# EAGLE design Set-Mile-Bottom (EAGLE 9.6.2)
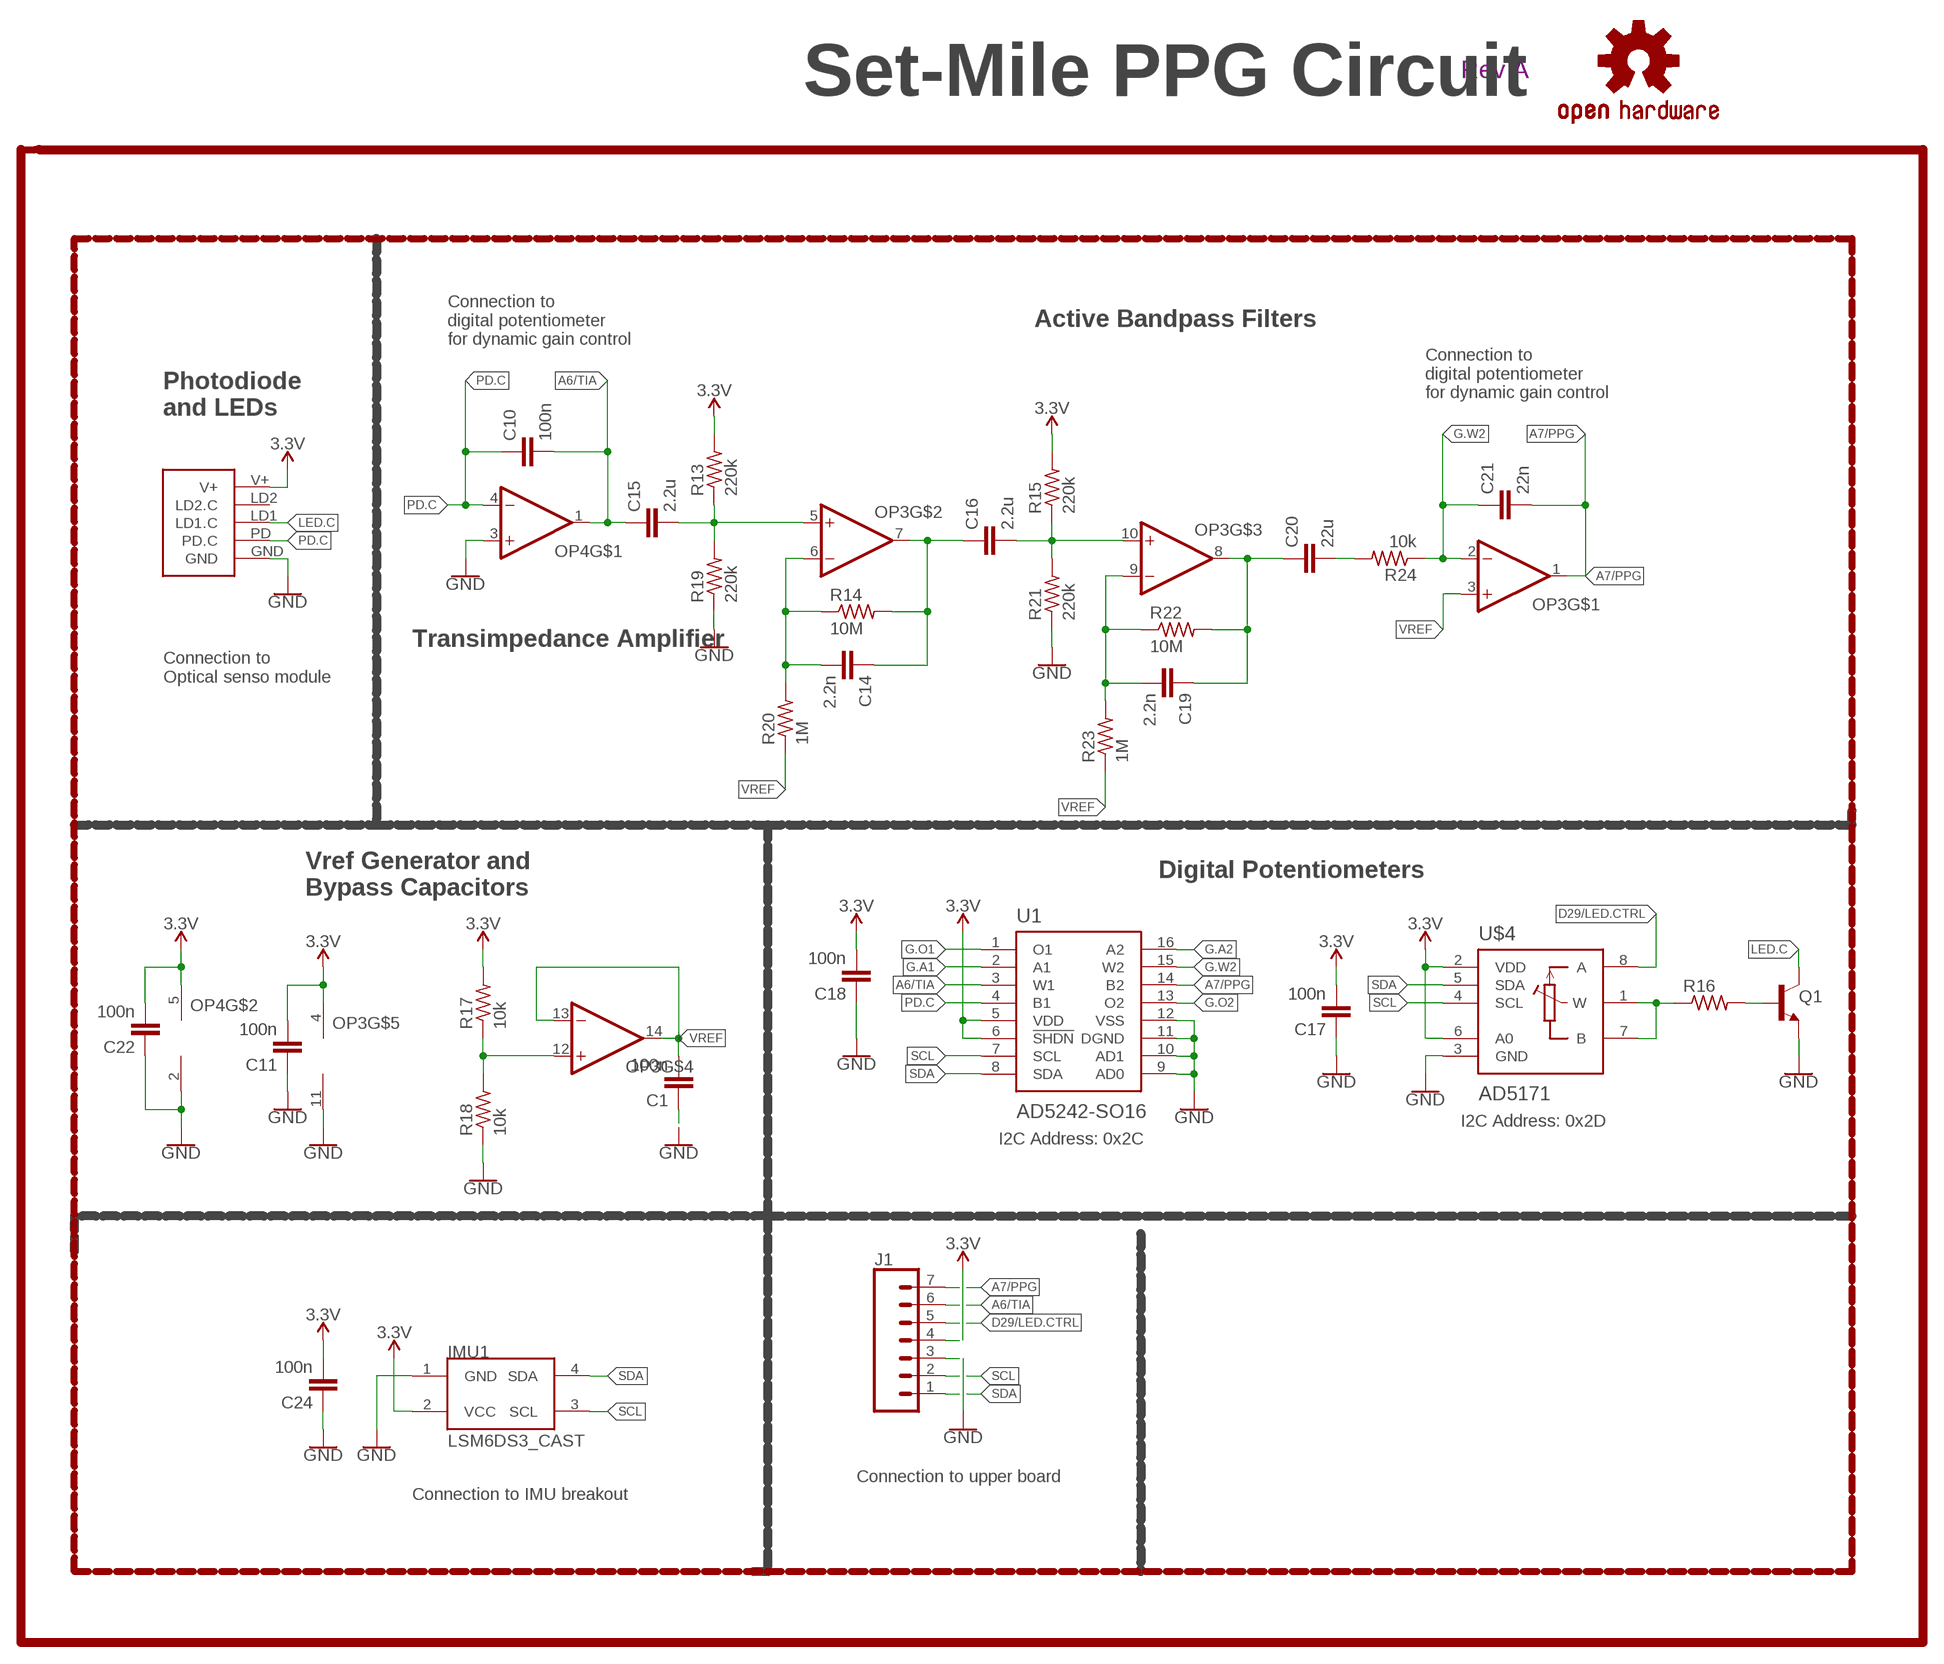
[diagram p0: schematic, sheet 1]

## Parts
C1  100n  CAPACITOR0603  [C0603]
C10  100n  CAPACITOR0603  [C0603]
C11  100n  CAPACITOR0603  [C0603]
C14  2.2n  CAPACITOR0603  [C0603]
C15  2.2u  CAPACITOR0603  [C0603]
C16  2.2u  CAPACITOR0603  [C0603]
C17  100n  CAPACITOR0603  [C0603]
C18  100n  CAPACITOR0603  [C0603]
C19  2.2n  CAPACITOR0603  [C0603]
C20  22u  CAPACITOR0603  [C0603]
C21  22n  CAPACITOR0603  [C0603]
C22  100n  CAPACITOR0603  [C0603]
C24  100n  CAPACITOR0603  [C0603]
IMU1  LSM6DS3_CAST  [LSM6DS3_CAST]
J1  CONN_07-1.27MM  [1X07_1.27MM]
LOGO1  REVISION.A  [REV.A]
LOGO2  OSHW-LOGOL  [OSHW-LOGO-L]
OP3  OP-QUAD-SO14  [SO14]
OP4  OP-SINGLEOT  [SOT23-5]
Q1  NPN-GENERIC  [SOT23-3]
R13  220k  RESISTOR0603  [R0603]
R14  10M  RESISTOR0603  [R0603]
R15  220k  RESISTOR0603  [R0603]
R16  RESISTOR0603  [R0603]
R17  10k  RESISTOR0402  [R0402]
R18  10k  RESISTOR0402  [R0402]
R19  220k  RESISTOR0603  [R0603]
R20  1M  RESISTOR0603  [R0603]
R21  220k  RESISTOR0603  [R0603]
R22  10M  RESISTOR0603  [R0603]
R23  1M  RESISTOR0603  [R0603]
R24  10k  RESISTOR0603  [R0603]
U1  AD5242-SO16  [SO16]
U$3  PPG.MODULE.2  [PPG.MODULE.2]
U$4  AD5171  [SOT-23-8]

## Nets
3.3V: C11.2 C17.2 C18.2 C22.2 C24.2 IMU1.2(VCC) J1.4 OP3.4(V+) OP4.5(V+) R13.2 R15.2 R17.2 U1.5(VDD) U1.6(!SHDN) U$3.V+ U$4.2(VDD) U$4.6(A0)
A6/TIA: C10.2 C15.1 J1.6 OP4.1(OUT) U1.3(W1)
A7/PPG: C21.2 J1.7 OP3.1(OUT) U1.14(B2)
D29/LED.CTRL: J1.5 U$4.8(A)
G.A1: U1.2(A1)
G.A2: U1.16(A2)
G.O1: U1.1(O1)
G.O2: U1.13(O2)
G.W2: C21.1 OP3.2(-IN) R24.1 U1.15(W2)
GND: C1.1 C11.1 C17.1 C18.1 C22.1 C24.1 IMU1.1(GND) J1.3 OP3.11(V-) OP4.2(V-) OP4.3(+IN) Q1.2(E) R18.1 R19.1 R21.1 U1.9(AD0) U1.10(AD1) U1.11(DGND) U1.12(VSS) U$3.GND U$4.3(GND)
LED.C: Q1.3(C) U$3.LD1(LD1.C)
N$8: Q1.1(B) R16.2
N$9: R16.1 U$4.1(W) U$4.7(B)
N$10: OP3.12(+IN) R17.1 R18.2
N$13: C15.2 OP3.5(+IN) R13.1 R19.2
N$15: C14.2 OP3.6(-IN) R14.1 R20.2
N$16: C14.1 C16.1 OP3.7(OUT) R14.2
N$17: C16.2 OP3.10(+IN) R15.1 R21.2
N$18: C19.2 OP3.9(-IN) R22.1 R23.2
N$19: C19.1 C20.1 OP3.8(OUT) R22.2
N$20: C20.2 R24.2
PD.C: C10.1 OP4.4(-IN) U1.4(B1) U$3.PD(PD.C)
SCL: IMU1.3(SCL) J1.2 U1.7(SCL) U$4.4(SCL)
SDA: IMU1.4(SDA) J1.1 U1.8(SDA) U$4.5(SDA)
VREF: C1.2 OP3.3(+IN) OP3.13(-IN) OP3.14(OUT) R20.1 R23.1
Unconnected: U$3.LD2(LD2.C)

## Notes on the sheet
- Set-Mile PPG Circuit
- Active Bandpass Filters
- Connection to
  digital potentiometer
  for dynamic gain control
- Connection to
  digital potentiometer
  for dynamic gain control
- Photodiode
  and LEDs
- Transimpedance Amplifier
- Connection to
  Optical senso module
- Digital Potentiometers
- Vref Generator and 
  Bypass Capacitors
- I2C Address: 0x2D
- I2C Address: 0x2C
- Connection to upper board
- Connection to IMU breakout

## Library data of the parts
C1 C10 C11 C14-C22 C24 = LinnesLab-Passives:CAPACITOR
IMU1 = LinnesLab-Sensors:LSM6DS3_CAST
J1 = LinnesLab-Connectors:CONN_07: Multi connection point. Often used as Generic Header-pin footprint for 0.1 inch spaced/style header connections On any of the 0.1 inch spaced packages, you can populate with these: Break Away Headers - Straight <https://www.sparkfun.com/products/116> (PRT-00116) Break Away Male Headers - Right Angle <https://www.sparkfun.com/products/553> (PRT-00553) Female Headers <https://www.sparkfun.com/products/115> (PRT-00115) Break Away Headers - Machine Pin <https://www.sparkfun.com/products/117> (PRT-00117) Break Away Female Headers - Swiss Machine Pin <https://www.sparkfun.com/products/743> (PRT-00743) For SCREWTERMINALS and SPRING TERMINALS visit here: Screw Terimnals on SparkFun.com <https://www.sparkfun.com/search/results?term=Screw+Terminals> (5mm/3.5mm/2.54mm spacing) This device is also useful as a general connection point to wire up your design to another part of your project. Our various solder wires solder well into these plated through hole pads. Hook-Up Wire - Assortment (Stranded, 22 AWG) <https://www.sparkfun.com/products/11375> (PRT-11375) Hook-Up Wire - Assortment (Solid Core, 22 AWG) <https://www.sparkfun.com/products/11367> (PRT-11367) View the entire wire category on our website here <https://www.sparkfun.com/categories/141> Special notes: Molex polarized connector foot print use with SKU : PRT-08231 with associated crimp pins and housings. 1MM SMD Version SKU: PRT-10208 NOTES ON THE VARIANTS LOCK and LOCK_LONGPADS... This footprint was designed to help hold the alignment of a through-hole component (i.e. 6-pin header) while soldering it into place. You may notice that each hole has been shifted either up or down by 0.005 of an inch from it's more standard position (which is a perfectly straight line). This slight alteration caused the pins (the squares in the middle) to touch the edges of the holes. Because they are alternating, it causes a "brace" to hold the component in place. 0.005 has proven to be the perfect amount of "off-center" position when using our standard breakaway headers. Although looks a little odd when you look at the bare footprint, once you have a header in there, the alteration is very hard to notice. Also,if you push a header all the way into place, it is covered up entirely on the bottom side.
LOGO1 = LinnesLab-Logos:REVISION.A
LOGO2 = LinnesLab-Logos:OSHW-LOGO: Open-Source Hardware (OSHW) Logo This logo indicates the piece of hardware it is found on incorporates a OSHW license and/or adheres to the definition of open source hardware found here: http://freedomdefined.org/OSHW
OP3 = LinnesLab-AnalogIC:OP-QUAD: General symbol and footprints for Quad Op Amps. Use with any standard general purpose op amp.
OP4 = LinnesLab-AnalogIC:OP-SINGLE: Single Op Amp 2.7V to 6.0V Single Supply CMOS Source: http://ww1.microchip.com/downloads/en/DeviceDoc/21314g.pdf
Q1 = LinnesLab-DiscreteSemi:NPN
R13-R24 = LinnesLab-Passives:RESISTOR
U1 = LinnesLab-DigitalIC:AD5242
U$3 = LinnesLab-Connectors:PPG.MODULE.2: Digi-Key Part Number: S9014E-50-ND Manufacturer Part Number: GRPB501VWVN-RC Description: 1mm insulation height 0.05in pitch 50 positions
U$4 = LinnesLab-DigitalIC:AD5171

## Net classes
1 power: width 0.254 mm

## Board
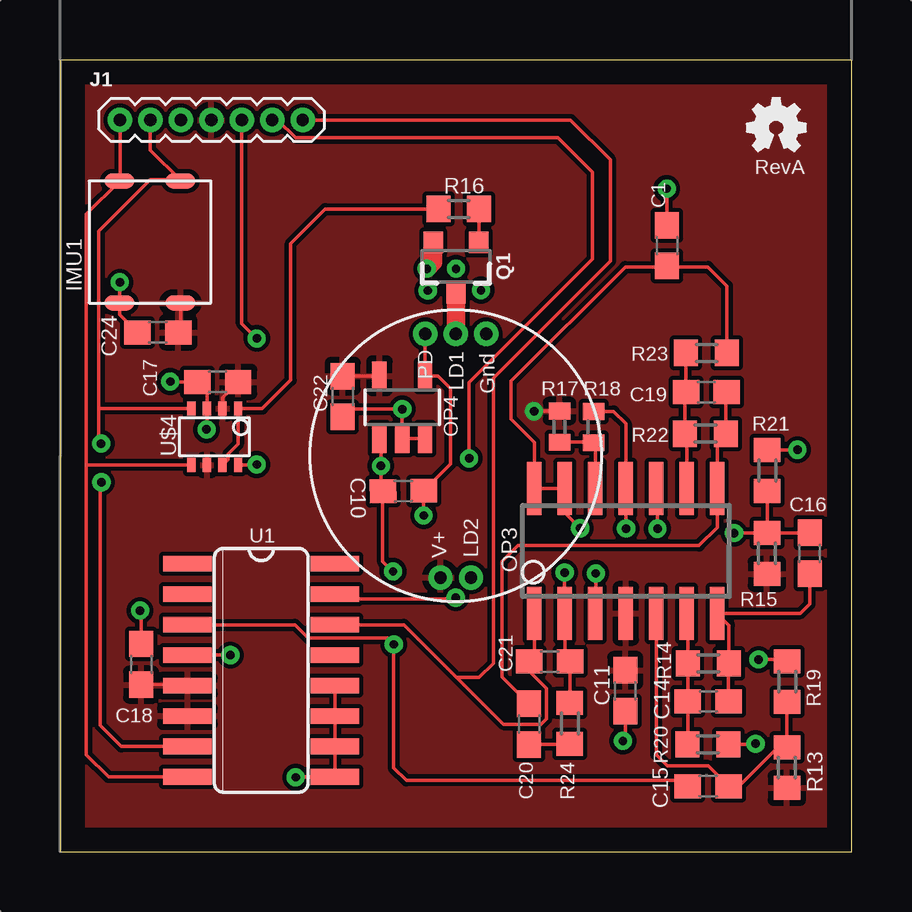
[diagram p1: board, top side]
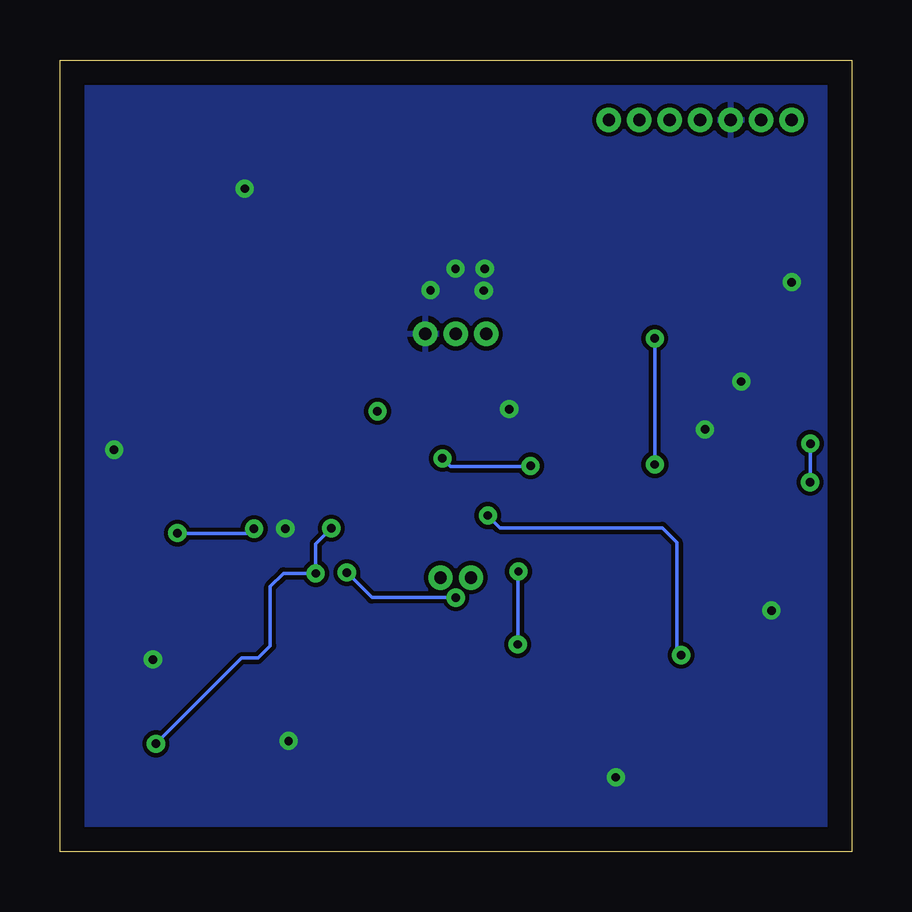
[diagram p2: board, bottom side, seen from below]

Size 33 x 33 mm. Coordinates in mm from the lower left corner, seen from the top.
Outline: 0,0 33,0 33,33 0,33 0,0
Copper layers (1*16): Top 0.035mm / dielectric 1.5mm / Bottom 0.035mm
Design rules "default": minimum track width 6mil, minimum drill 0.35mm, track to track 6mil, track to pad 6mil, pad to pad 6mil, via to via 6mil, smd to smd 6mil, copper to edge 40mil, drill to drill 6mil, minimum pad ring 10mil, minimum via ring 8mil, stop-mask expansion 4mil, vias tented up to drill 0mil, thermal gap 10mil

### Footprints (pad centres in the part's own frame; a part is rotated, then mirrored left to right if it is on the bottom)
C0603 = smd 1.1 x 1: 1 -0.85,0; 2 0.85,0
LSM6DS3_CAST = smd 0.635 x 1.27: 1 -2.54,1.27; 2 -2.54,-1.27; 3 2.54,-1.27; 4 2.54,1.27
1X07_1.27MM = drill 0.508 pad 1: 1 0,0; 2 1.27,0; 3 2.54,0; 4 3.81,0; 5 5.08,0; 6 6.35,0; 7 7.62,0
SO14 = smd 0.6 x 2.2: 1 -3.81,-2.6; 2 -2.54,-2.6; 3 -1.27,-2.6; 4 0,-2.6; 5 1.27,-2.6; 6 2.54,-2.6; 7 3.81,-2.6; 8 3.81,2.6; 9 2.54,2.6; 10 1.27,2.6; 11 0,2.6; 12 -1.27,2.6; 13 -2.54,2.6; 14 -3.81,2.6
SOT23-5 = smd 0.6 x 1.2: 1 -0.95,-1.306; 2 0,-1.306; 3 0.95,-1.306; 4 0.95,1.306; 5 -0.95,1.306
SOT23-3 = smd 0.8 x 0.9: 1 -0.95,-1; 2 0.95,-1; 3 0,1.1
R0603 = smd 1 x 1.1: 1 -0.85,0; 2 0.85,0
R0402 = smd 0.7 x 0.9: 1 -0.65,0; 2 0.65,0
SO16 = smd 0.66 x 2.032: 1 -4.445,-3.073; 2 -3.175,-3.073; 3 -1.905,-3.073; 4 -0.635,-3.073; 5 0.635,-3.073; 6 1.905,-3.073; 7 3.175,-3.073; 8 4.445,-3.073; 9 4.445,3.073; 10 3.175,3.073; 11 1.905,3.073; 12 0.635,3.073; 13 -0.635,3.073; 14 -1.905,3.073; 15 -3.175,3.073; 16 -4.445,3.073
PPG.MODULE.2 = drill 0.508 pad 0.94: GND 1.27,5.08; LD1 0,5.08; LD2 0.635,-5.08; PD -1.27,5.08; V+ -0.635,-5.08
SOT-23-8 = smd 0.35 x 0.6: 1 -0.991,-1.176; 2 -0.341,-1.176; 3 0.309,-1.176; 4 0.959,-1.176; 5 0.959,1.176; 6 0.309,1.176; 7 -0.341,1.176; 8 -0.991,1.176

### Placement (x,y rotation side)
C1  25.3,25.26 270 top
C10  14.32,15.03 180.6 top
C11  23.56,6.7 90 top
C14  27.02,6.27 180 top
C15  27.02,2.72 0 top
C16  31.26,12.44 90 top
C17  6.58,19.58 0 top
C18  3.39,7.81 270 top
C19  26.95,19.15 180 top
C20  19.55,5.32 270 top
C21  20.42,7.93 180 top
C22  11.79,18.97 90 top
C24  4.08,21.65 0 top
IMU1  3.75,25.41 90 top
J1  2.5,30.5 0 top
LOGO1  28.97,28.24 0 top
LOGO2  -4.62,-6.11 0 top  (outside the outline)
OP3  23.59,12.53 0 top
OP4  14.27,18.52 0 top
Q1  16.51,24.39 180 top
R13  30.31,3.5 270 top
R14  27.03,7.84 0 top
R15  29.48,12.43 270 top
R16  16.63,26.78 0 top
R17  20.83,17.71 90 top
R18  22.24,17.7 270 top
R19  30.32,7.08 270 top
R20  27.01,4.47 180 top
R21  29.48,15.89 270 top
R22  26.91,17.42 0 top
R23  26.95,20.79 180 top
R24  21.25,5.34 270 top
U1  8.39,7.55 270 top
U$1  [OSHW-LOGO-MINI]  29.86,30.19 0 top
U$3  16.5,16.5 0 top
U$4  6.44,17.29 180 top

### Tracks (layer width: path | path; a pad name or v marks a point on that pad's centre or on a via)
3.3V  (via drill 0.35)
  Top 0.152: R17.2 v19.77,18.36 v19.76,18.36 | C18.2 5.25,6.98 U1.5 | C22.2 11.8,19.83 OP4.5 | C24.2 5.02,21.73 IMU1.2 | U$4.2 6.78,18.93 C17.2 | 6.13,16.47 U$4.6
  pour Top (isolate 0.178): 0.65,32.5 32.4,32.5 32.4,0.83 0.65,0.83
A6/TIA  (via drill 0.35)
  Top 0.152: OP4.1 13.38,17.16 v13.38,16.08 13.38,15.11 C10.2 13.46,15.02 13.46,12.1 v13.89,11.68 | C15.1 25.93,2.96 14.44,2.96 13.91,3.48 v13.91,8.63 13.65,8.9 10.35,8.9 9.79,9.46 U1.3 | J1.6 9.08,30.5 9.81,29.76 20.76,29.76 22.2,28.32 22.2,24.69 17.05,19.55 v17.05,16.4 v17.05,16.39
  Bottom 0.152: v13.89,11.68 13.91,11.65 v13.91,8.64 v13.91,8.63 | v17.05,16.39 16.71,16.05 13.4,16.05 v13.38,16.08
A7/PPG
  Top 0.152: OP3.1 19.78,8.14 C21.2 19.57,7.52 20.28,6.81 20.28,5.52 20.06,5.3 18.49,5.3 16.54,7.26 | U1.14 14.34,9.46 16.54,7.26 | 16.54,7.26 17.47,7.26 18.07,7.85 18.07,19.74 22.94,24.62 22.94,28.84 21.29,30.5 J1.7
D29/LED.CTRL  (via drill 0.35)
  Top 0.152: v8.2,16.13 8.18,16.11 U$4.8 | v8.2,21.39 7.58,22.02 J1.5
  Bottom 0.152: v8.2,16.13 v8.2,21.39
G.W2  (via drill 0.35)
  Top 0.152: R24.1 21.25,7.91 C21.1 21.05,8.14 OP3.2 v21.04,11.63 | v16.5,10.59 16.44,10.52 11.67,10.52 U1.15
  Bottom 0.152: v16.5,10.59 20,10.59 v21.04,11.63
GND  (via drill 0.35)
  Top 0.152: v23.61,13.46 23.59,13.48 OP3.11 23.59,17.84 23.08,18.35 R18.1 | R21.1 30.73,16.74 v30.74,16.75 | R19.1 30.24,8.01 v29.12,8.01 | C11.1 23.56,4.71 v23.47,4.61 | C18.1 3.38,10 v3.34,10.05 | C22.1 12.12,18.45 v14.27,18.45 | v14.27,18.45 OP4.2 OP4.3 | v14.27,18.45 | U1.12 U1.11 U1.10 U1.9 9.84,3.11 v9.83,3.09 | C24.1 2.48,22.39 IMU1.1 2.48,23.72 v2.5,23.73 | v6.11,17.6 6.13,17.62 U$4.3 6.13,19.17 C17.1 4.61,19.58 v4.6,19.59 | C1.1 v25.3,27.64
  Top 0.762: Q1.2 15.56,24.57 v15.29,24.3
  other vias: 15.33,23.39 17.55,23.4 16.51,24.3
  pour Bottom (isolate 0.178): 0.94,32.75 32.72,32.75 32.72,0.53 0.94,0.53
LED.C
  Top 0.762: Q1.3 16.51,21.59 U$3.LD1
N$8
  Top 0.152: R16.2 17.48,25.41 Q1.1
N$9
  Top 0.152: R16.1 11.06,26.78 9.62,25.35 9.62,19.65 8.43,18.47 U$4.1 7.42,16.98 7.01,16.57 7.01,16.35 U$4.7
N$10
  Top 0.152: OP3.12 22.32,16.97 R18.2 22.22,17.06 R17.1
N$13
  Top 0.152: R19.2 30.31,6.22 R13.1 29.92,4.35 28.29,2.72 C15.2 27.03,3.56 25.33,3.56 24.86,4.04 OP3.5
N$15
  Top 0.152: OP3.6 26.18,9.88 R14.1 C14.2 26.18,4.48 R20.2
N$16
  Top 0.152: R14.2 C14.1 27.88,8.02 27.89,8.03 27.89,9.44 OP3.7 30.87,9.93 31.26,10.31 C16.1
N$17  (via drill 0.35)
  Top 0.152: R15.1 C16.2 | R15.1 R21.2 | v28.11,13.28 R15.1 | v24.91,13.46 24.91,15.08 OP3.10
  Bottom 0.152: v28.11,13.28 28.09,13.26 25.11,13.26 v24.91,13.46
N$18
  Top 0.152: OP3.9 26.13,17.35 R22.1 26.06,19.11 C19.2 R23.2
N$19
  Top 0.152: C20.1 18.44,7.28 18.44,12.09 19.1,12.76 26.64,12.76 27.4,13.51 OP3.8 27.4,17.06 R22.2 27.76,19.11 C19.1
N$20
  Top 0.152: C20.2 21.23,4.47 R24.2
PD.C  (via drill 0.35)
  Top 0.152: U$3.PD 15.22,21.57 OP4.4 15.75,19.83 16.27,19.31 16.27,16.15 C10.1 v15.16,14.01 | U1.4 v7.1,8.19
  Bottom 0.152: v7.1,8.19 7.28,8.37 7.28,12.89 7.89,13.5 14.65,13.5 v15.16,14.01
SCL  (via drill 0.35)
  Top 0.152: J1.2 3.77,29.24 5.02,27.99 IMU1.3 4.97,28.01 3.77,28.01 1.62,25.86 1.62,18.47 | U1.7 2.56,4.38 1.68,5.26 1.68,15.35 v1.73,15.4 | 1.62,18.47 1.62,17.1 v1.72,17.01 | U$4.4 1.62,18.47
  Bottom 0.152: v1.72,17.01 1.73,17 v1.73,15.4
SDA
  Top 0.152: J1.1 2.5,27.97 IMU1.4 1.1,26.57 1.1,16.16 | 1.1,16.16 1.1,4.03 2.02,3.11 U1.8 | U$4.5 1.14,16.11 1.1,16.16
VREF  (via drill 0.35)
  Top 0.152: R23.1 27.8,23.58 27.02,24.37 25.26,24.37 | R20.1 28.98,4.47 v29,4.49 | v22.34,11.59 22.34,9.95 OP3.3 | v21.69,13.48 21.05,14.12 OP3.13 OP3.14 19.78,17.06 18.81,18.03 18.81,19.61 23.57,24.37 25.23,24.37 25.26,24.37 | C1.2 25.26,24.37
  Bottom 0.152: v29,4.49 25.43,8.07 24.75,8.07 24.24,8.58 24.24,11.04 23.68,11.59 v22.34,11.59 22.34,12.83 v21.69,13.48